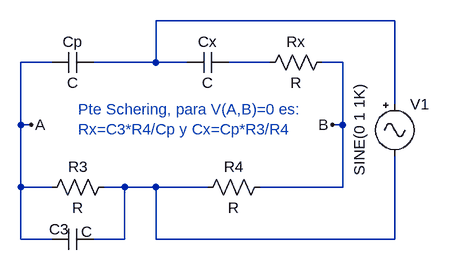
[diagram p0: schematic CxSchering.asc]
CxSchering.asc, the LTspice schematic file:
Version 4
SHEET 1 880 680
WIRE -112 192 -112 96
WIRE -112 288 -112 192
WIRE -112 368 -112 288
WIRE -96 192 -112 192
WIRE -64 96 -112 96
WIRE -64 288 -112 288
WIRE -64 368 -112 368
WIRE 48 288 16 288
WIRE 48 368 0 368
WIRE 48 368 48 288
WIRE 96 96 0 96
WIRE 96 96 96 32
WIRE 96 288 48 288
WIRE 96 368 96 288
WIRE 144 96 96 96
WIRE 176 288 96 288
WIRE 272 96 208 96
WIRE 384 96 352 96
WIRE 384 192 368 192
WIRE 384 192 384 96
WIRE 384 288 256 288
WIRE 384 288 384 192
WIRE 464 32 96 32
WIRE 464 160 464 32
WIRE 464 368 96 368
WIRE 464 368 464 240
FLAG -96 192 A
FLAG 368 192 B
SYMBOL cap 0 80 R90
WINDOW 0 0 32 VBottom 0
WINDOW 3 32 32 VTop 0
SYMATTR InstName Cp
SYMBOL cap 208 80 R90
WINDOW 0 0 32 VBottom 0
WINDOW 3 32 32 VTop 0
SYMATTR InstName Cx
SYMBOL res 368 80 R90
WINDOW 0 0 56 VBottom 0
WINDOW 3 32 56 VTop 0
SYMATTR InstName Rx
SYMBOL res 32 272 R90
WINDOW 0 0 56 VBottom 0
WINDOW 3 32 56 VTop 0
SYMATTR InstName R3
SYMBOL cap 0 352 R90
WINDOW 0 16 53 VBottom 0
WINDOW 3 -11 10 VTop 0
SYMATTR InstName C3
SYMBOL res 272 272 R90
WINDOW 0 0 56 VBottom 0
WINDOW 3 32 56 VTop 0
SYMATTR InstName R4
SYMBOL Misc\\signal 464 144 R0
WINDOW 3 -54 -15 VRight 0
WINDOW 123 0 0 Left 0
WINDOW 39 0 0 Left 0
SYMATTR InstName V1
TEXT -24 168 Left 0 ;Pte Schering, para V(A,B)=0 es:\nRx=C3*R4/Cp y Cx=Cp*R3/R4

The netlist it stands for:
* CxSchering.asc
Cp N002 A C
Cx N003 N002 C
Rx B N003 R
R3 N001 A R
C3 N001 A C
R4 B N001 R
V1 N002 N001 SINE(0 1 1K)
* Pte Schering, para V(A,B)=0 es:
* Rx=C3*R4/Cp y Cx=Cp*R3/R4
.backanno
.end